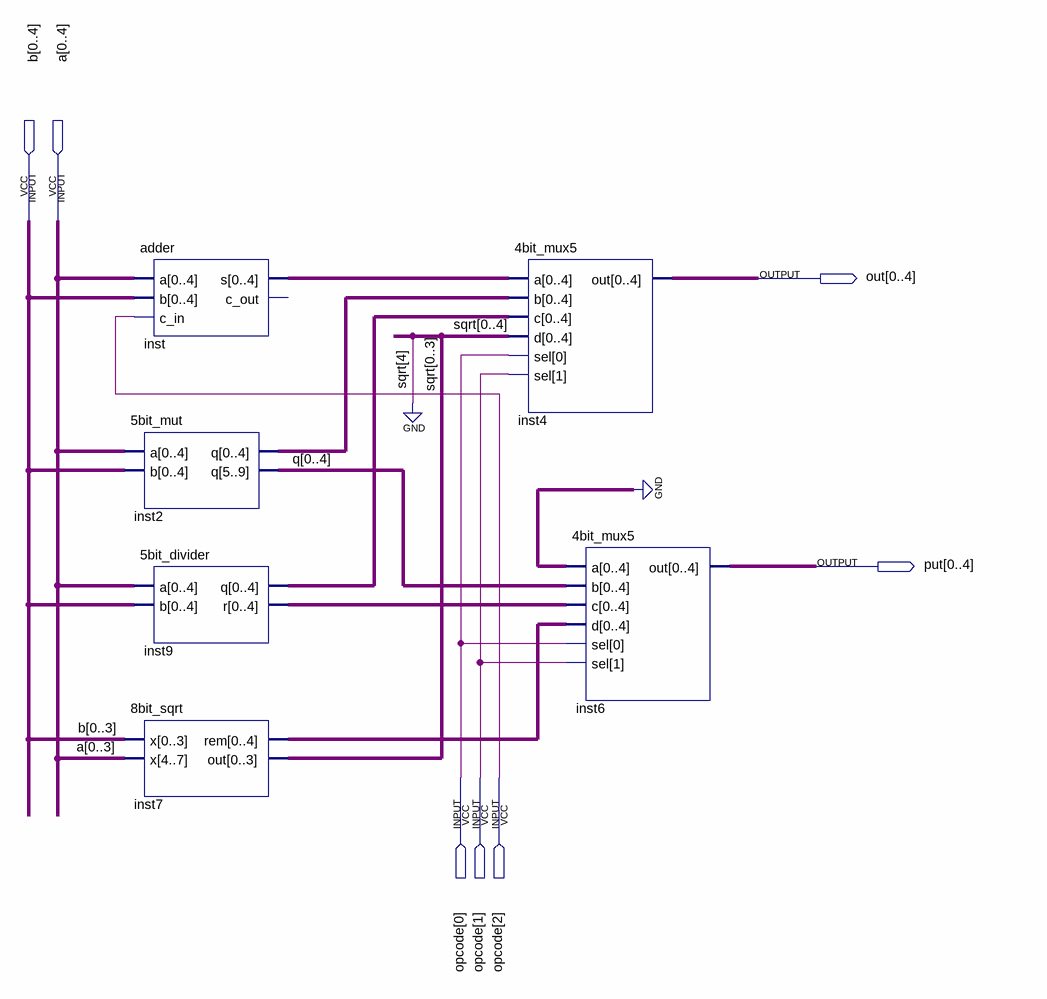
[diagram p0: schematic sheet]
// Quartus schematic ula.bdf as structural Verilog: 6 symbols, 7 pins
module ula (
  input  [0:4] b,
  input  [0:4] a,
  input  [2:0] opcode,
  output [0:4] out,
  output [0:4] put
);

  wire [3:0] sqrt;
  wire [4:0] inst2_q, inst7_rem, inst9_q, inst9_r, inst_s, q;

  adder inst (.a(a), .b(b), .c_in(opcode[2]), .s(inst_s));  // open: c_out
  \5bit_mut  inst2 (.a(a), .b(b), .q({q, inst2_q[0], inst2_q[1], inst2_q[2], inst2_q[3], inst2_q[4]}));
  \5bit_divider  inst9 (.a(a), .b(b), .q(inst9_q), .r(inst9_r));
  \8bit_sqrt  inst7 (
    .x({a[3], a[2], a[1], a[0], b[3], b[2], b[1], b[0]}), .rem(inst7_rem),
    .out({sqrt[0], sqrt[1], sqrt[2], sqrt[3]}));
  \4bit_mux5  inst4 (
    .a(inst_s), .b(inst2_q), .c(inst9_q), .d({sqrt[0], sqrt[1], sqrt[2], sqrt[3], 1'b0}), .sel(opcode[1:0]),
    .out(out));
  \4bit_mux5  inst6 (
    .a({5{1'b0}}), .b({q[0], q[1], q[2], q[3], q[4]}), .c(inst9_r), .d(inst7_rem), .sel(opcode[1:0]),
    .out(put));
endmodule
